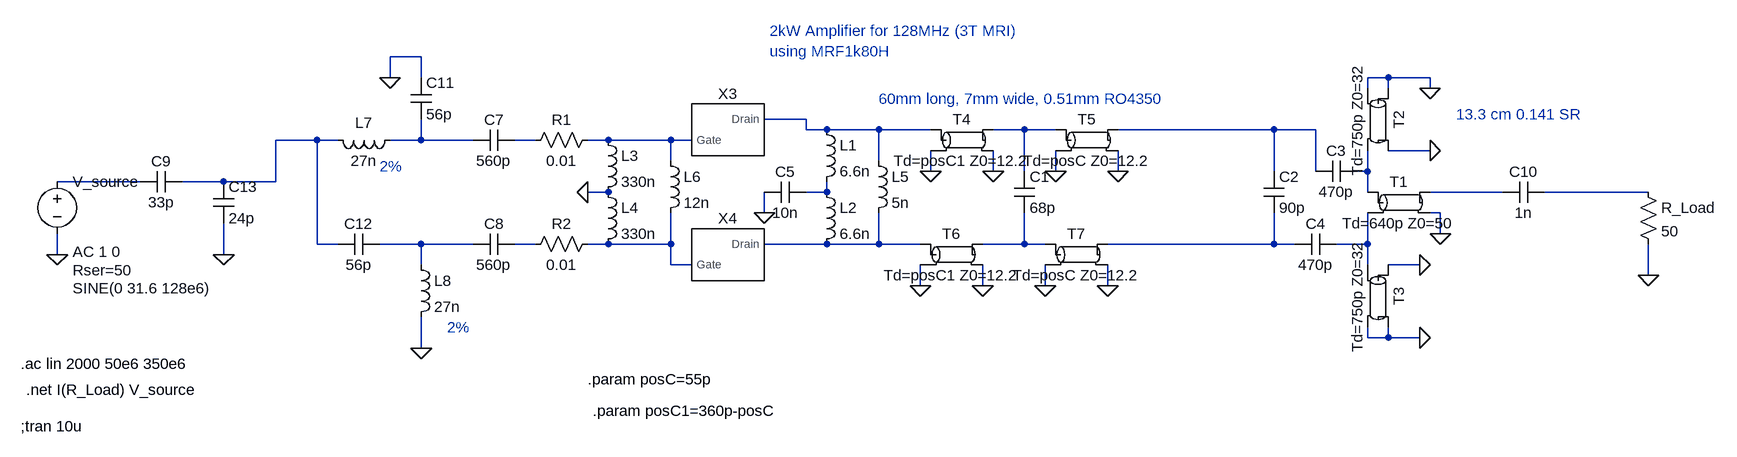
[diagram p0: schematic MRF1k80H_Board_50Ohm_longer_trace_no_Inductor_input_change_RO4350_Broad_input.asc]
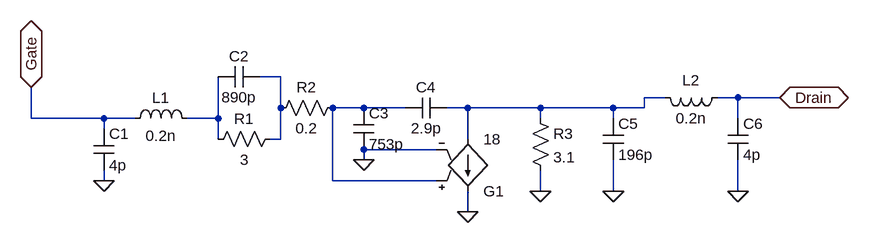
[diagram p1: sub-circuit mrfx1k80hhalf.asc]
MRF1k80H_Board_50Ohm_longer_trace_no_Inductor_input_change_RO4350_Broad_input.asc, the LTspice schematic file:
Version 4
SHEET 1 1664 680
WIRE -336 16 -384 16
WIRE -384 48 -384 16
WIRE -336 48 -336 16
WIRE 1152 48 1120 48
WIRE 1216 48 1152 48
WIRE 1120 64 1120 48
WIRE 1152 64 1152 48
WIRE 1216 64 1216 48
WIRE 256 112 192 112
WIRE 256 128 256 112
WIRE 288 128 256 128
WIRE 368 128 288 128
WIRE 448 128 368 128
WIRE 592 128 544 128
WIRE 640 128 592 128
WIRE 976 128 736 128
WIRE 1040 128 976 128
WIRE -496 144 -560 144
WIRE -464 144 -496 144
WIRE -336 144 -336 112
WIRE -336 144 -384 144
WIRE -256 144 -336 144
WIRE -160 144 -192 144
WIRE -48 144 -80 144
WIRE 48 144 -48 144
WIRE 80 144 48 144
WIRE 1216 160 1152 160
WIRE 48 176 48 144
WIRE 368 176 368 128
WIRE 448 192 448 160
WIRE 544 192 544 160
WIRE 592 192 592 128
WIRE 640 192 640 160
WIRE 736 192 736 160
WIRE 976 192 976 128
WIRE 1040 192 1040 128
WIRE 1120 192 1120 160
WIRE 1120 192 1104 192
WIRE -768 208 -896 208
WIRE -640 208 -704 208
WIRE -560 208 -560 144
WIRE -560 208 -640 208
WIRE -48 224 -80 224
WIRE 288 224 288 208
WIRE 288 224 256 224
WIRE 1120 224 1120 192
WIRE 1328 224 1216 224
WIRE 1552 224 1392 224
WIRE 192 256 192 224
WIRE 1232 256 1216 256
WIRE 1232 288 1232 256
WIRE -496 304 -496 144
WIRE -464 304 -496 304
WIRE -336 304 -400 304
WIRE -256 304 -336 304
WIRE -160 304 -192 304
WIRE -48 304 -80 304
WIRE 48 304 48 256
WIRE 48 304 -48 304
WIRE 288 304 192 304
WIRE 368 304 368 256
WIRE 368 304 288 304
WIRE 432 304 368 304
WIRE 592 304 592 256
WIRE 592 304 528 304
WIRE 624 304 592 304
WIRE 976 304 976 256
WIRE 976 304 720 304
WIRE 1008 304 976 304
WIRE 1120 304 1120 256
WIRE 1120 304 1072 304
WIRE -896 320 -896 288
WIRE -640 320 -640 272
WIRE -336 336 -336 304
WIRE 48 336 48 304
WIRE 80 336 48 336
WIRE 1120 336 1120 304
WIRE 1200 336 1152 336
WIRE 1552 352 1552 304
WIRE 432 368 432 336
WIRE 528 368 528 336
WIRE 624 368 624 336
WIRE 720 368 720 336
WIRE 1120 448 1120 432
WIRE 1152 448 1152 432
WIRE 1152 448 1120 448
WIRE 1200 448 1152 448
WIRE -336 464 -336 416
FLAG 1216 64 0
FLAG 1216 160 0
FLAG 1200 336 0
FLAG 1200 448 0
FLAG 1232 288 0
FLAG 192 256 0
FLAG 448 192 0
FLAG 544 192 0
FLAG 432 368 0
FLAG 528 368 0
FLAG 624 368 0
FLAG 720 368 0
FLAG 736 192 0
FLAG 640 192 0
FLAG 1552 352 0
FLAG -80 224 0
FLAG -640 320 0
FLAG -896 320 0
FLAG -336 464 0
FLAG -384 48 0
SYMBOL tline 1168 240 R0
SYMATTR InstName T1
SYMATTR Value Td=640p Z0=50
SYMBOL tline 1136 112 R90
SYMATTR InstName T2
SYMATTR Value Td=750p Z0=32
SYMBOL tline 1136 384 R90
SYMATTR InstName T3
SYMATTR Value Td=750p Z0=32
SYMBOL tline 496 144 R0
SYMATTR InstName T4
SYMATTR Value Td=posC1 Z0=12.2
SYMBOL tline 688 144 R0
SYMATTR InstName T5
SYMATTR Value Td=posC Z0=12.2
SYMBOL tline 480 320 R0
SYMATTR InstName T6
SYMATTR Value Td=posC1 Z0=12.2
SYMBOL tline 672 320 R0
SYMATTR InstName T7
SYMATTR Value Td=posC Z0=12.2
SYMBOL cap 576 192 R0
SYMATTR InstName C1
SYMATTR Value 68p
SYMATTR SpiceLine Rser=0.03
SYMBOL cap 960 192 R0
SYMATTR InstName C2
SYMATTR Value 90p
SYMATTR SpiceLine Rser=0.03
SYMBOL cap 1104 176 R90
WINDOW 0 0 32 VBottom 2
WINDOW 3 32 32 VTop 2
SYMATTR InstName C3
SYMATTR Value 470p
SYMBOL cap 1072 288 R90
WINDOW 0 0 32 VBottom 2
WINDOW 3 32 32 VTop 2
SYMATTR InstName C4
SYMATTR Value 470p
SYMBOL res 1536 208 R0
SYMATTR InstName R_Load
SYMATTR Value 50
SYMBOL ind 272 112 R0
SYMATTR InstName L1
SYMATTR Value 6.6n
SYMATTR SpiceLine Rser=0.04
SYMBOL ind 272 208 R0
SYMATTR InstName L2
SYMATTR Value 6.6n
SYMATTR SpiceLine Rser=0.04
SYMBOL cap 256 208 R90
WINDOW 0 0 32 VBottom 2
WINDOW 3 32 32 VTop 2
SYMATTR InstName C5
SYMATTR Value 10n
SYMBOL ind -64 128 R0
SYMATTR InstName L3
SYMATTR Value 330n
SYMATTR SpiceLine Rser=1 Rpar=1000000
SYMBOL ind -64 208 R0
SYMATTR InstName L4
SYMATTR Value 330n
SYMATTR SpiceLine Rser=1 Rpar=1000000
SYMBOL cap -192 128 R90
WINDOW 0 0 32 VBottom 2
WINDOW 3 32 32 VTop 2
SYMATTR InstName C7
SYMATTR Value 560p
SYMATTR SpiceLine Rser=0.01
SYMBOL cap -192 288 R90
WINDOW 0 0 32 VBottom 2
WINDOW 3 32 32 VTop 2
SYMATTR InstName C8
SYMATTR Value 560p
SYMATTR SpiceLine Rser=0.01
SYMBOL cap -704 192 R90
WINDOW 0 0 32 VBottom 2
WINDOW 3 32 32 VTop 2
SYMATTR InstName C9
SYMATTR Value 33p
SYMATTR SpiceLine Rser=0.25
SYMBOL voltage -896 192 R0
WINDOW 3 24 180 Left 2
WINDOW 123 24 124 Left 2
WINDOW 39 24 152 Left 2
SYMATTR Value SINE(0 31.6 128e6)
SYMATTR Value2 AC 1 0
SYMATTR SpiceLine Rser=50
SYMATTR InstName V_source
SYMBOL cap 1392 208 R90
WINDOW 0 0 32 VBottom 2
WINDOW 3 32 32 VTop 2
SYMATTR InstName C10
SYMATTR Value 1n
SYMBOL ind -368 128 R90
WINDOW 0 5 56 VBottom 2
WINDOW 3 32 56 VTop 2
SYMATTR InstName L7
SYMATTR Value 27n
SYMATTR SpiceLine Rser=0.1
SYMBOL ind -352 320 R0
SYMATTR InstName L8
SYMATTR Value 27n
SYMATTR SpiceLine Rser=0.1
SYMBOL cap -352 48 R0
SYMATTR InstName C11
SYMATTR Value 56p
SYMATTR SpiceLine Rser=0.02
SYMBOL cap -400 288 R90
WINDOW 0 0 32 VBottom 2
WINDOW 3 32 32 VTop 2
SYMATTR InstName C12
SYMATTR Value 56p
SYMATTR SpiceLine Rser=0.02
SYMBOL cap -656 208 R0
SYMATTR InstName C13
SYMATTR Value 24p
SYMATTR SpiceLine Rser=0.5
SYMBOL res -64 128 R90
WINDOW 0 0 56 VBottom 2
WINDOW 3 32 56 VTop 2
SYMATTR InstName R1
SYMATTR Value 0.01
SYMBOL res -64 288 R90
WINDOW 0 0 56 VBottom 2
WINDOW 3 32 56 VTop 2
SYMATTR InstName R2
SYMATTR Value 0.01
SYMBOL MRFX1k80Hhalf 128 128 R0
SYMATTR InstName X3
SYMBOL MRFX1k80Hhalf 128 320 R0
SYMATTR InstName X4
SYMBOL ind 352 160 R0
SYMATTR InstName L5
SYMATTR Value 5n
SYMBOL ind 32 160 R0
SYMATTR InstName L6
SYMATTR Value 12n
TEXT -80 512 Left 2 !.param posC=55p
TEXT 200 -24 Left 2 ;2kW Amplifier for 128MHz (3T MRI)\nusing MRF1k80H
TEXT -952 488 Left 2 !.ac lin 2000 50e6 350e6
TEXT -944 528 Left 2 !.net I(R_Load) V_source
TEXT -72 560 Left 2 !.param posC1=360p-posC
TEXT -952 584 Left 2 !;tran 10u
TEXT 1256 104 Left 2 ;13.3 cm 0.141 SR
TEXT 368 80 Left 2 ;60mm long, 7mm wide, 0.51mm RO4350
TEXT -296 432 Left 2 ;2%
TEXT -400 184 Left 2 ;2%

mrfx1k80hhalf.asc, the sub-circuit schematic file:
Version 4
SHEET 1 1228 680
WIRE 336 48 304 48
WIRE 928 80 896 80
WIRE 1040 80 1008 80
WIRE 1104 80 1040 80
WIRE 336 96 336 48
WIRE 464 96 416 96
WIRE 528 96 464 96
WIRE 624 96 592 96
WIRE 736 96 624 96
WIRE 848 96 736 96
WIRE 896 96 896 80
WIRE 896 96 848 96
WIRE -48 112 -48 64
WIRE 64 112 -48 112
WIRE 112 112 64 112
WIRE 240 112 240 48
WIRE 240 112 192 112
WIRE 736 112 736 96
WIRE 848 112 848 96
WIRE 1040 112 1040 80
WIRE 64 128 64 112
WIRE 240 144 240 112
WIRE 336 144 336 96
WIRE 336 144 320 144
WIRE 624 144 624 96
WIRE 576 160 464 160
WIRE 464 176 464 160
WIRE 64 208 64 192
WIRE 416 208 416 96
WIRE 576 208 416 208
WIRE 736 224 736 192
WIRE 848 224 848 176
WIRE 1040 224 1040 176
WIRE 624 256 624 224
FLAG 64 208 0
FLAG 464 176 0
FLAG 624 256 0
FLAG 736 224 0
FLAG 848 224 0
FLAG 1040 224 0
FLAG -48 64 Gate
IOPIN -48 64 BiDir
FLAG 1104 80 Drain
IOPIN 1104 80 BiDir
SYMBOL cap 48 128 R0
SYMATTR InstName C1
SYMATTR Value 4p
SYMBOL ind 96 128 R270
WINDOW 0 32 56 VTop 2
WINDOW 3 5 56 VBottom 2
SYMATTR InstName L1
SYMATTR Value 0.2n
SYMBOL cap 304 32 R90
WINDOW 0 0 32 VBottom 2
WINDOW 3 32 32 VTop 2
SYMATTR InstName C2
SYMATTR Value 890p
SYMBOL res 336 128 R90
WINDOW 0 0 56 VBottom 2
WINDOW 3 32 56 VTop 2
SYMATTR InstName R1
SYMATTR Value 3
SYMBOL res 432 80 R90
WINDOW 0 0 56 VBottom 2
WINDOW 3 32 56 VTop 2
SYMATTR InstName R2
SYMATTR Value 0.2
SYMBOL cap 448 96 R0
SYMATTR InstName C3
SYMATTR Value 753p
SYMBOL cap 592 80 R90
WINDOW 0 0 32 VBottom 2
WINDOW 3 32 32 VTop 2
SYMATTR InstName C4
SYMATTR Value 2.9p
SYMBOL g 624 240 M180
SYMATTR InstName G1
SYMATTR Value 18
SYMBOL res 720 96 R0
SYMATTR InstName R3
SYMATTR Value 3.1
SYMBOL cap 832 112 R0
SYMATTR InstName C5
SYMATTR Value 196p
SYMBOL ind 1024 64 R90
WINDOW 0 5 56 VBottom 2
WINDOW 3 32 56 VTop 2
SYMATTR InstName L2
SYMATTR Value 0.2n
SYMBOL cap 1024 112 R0
SYMATTR InstName C6
SYMATTR Value 4p

The netlist it stands for:
* MRF1k80H_Board_50Ohm_longer_trace_no_Inductor_input_change_RO4350_Broad_input.asc
T1 N008 N019 N011 0 Td=640p Z0=50
T2 0 0 0 N008 Td=750p Z0=32
T3 0 N019 0 0 Td=750p Z0=32
T4 N001 0 N002 0 Td=posC1 Z0=12.2
T5 N002 0 N003 0 Td=posC Z0=12.2
T6 N016 0 N017 0 Td=posC1 Z0=12.2
T7 N017 0 N018 0 Td=posC Z0=12.2
C1 N002 N017 68p Rser=0.03
C2 N003 N018 90p Rser=0.03
C3 N008 N003 470p
C4 N019 N018 470p
R_Load N012 0 50
L1 N001 N010 6.6n Rser=0.04
L2 N010 N016 6.6n Rser=0.04
C5 N010 0 10n
L3 N007 0 330n Rser=1 Rpar=1000000
L4 0 N015 330n Rser=1 Rpar=1000000
C7 N006 N005 560p Rser=0.01
C8 N014 N013 560p Rser=0.01
C9 N004 N009 33p Rser=0.25
V_source N009 0 SINE(0 31.6 128e6) AC 1 0 Rser=50
C10 N012 N011 1n
L7 N005 N004 27n Rser=0.1
L8 N013 0 27n Rser=0.1
C11 0 N005 56p Rser=0.02
C12 N013 N004 56p Rser=0.02
C13 N004 0 24p Rser=0.5
R1 N007 N006 0.01
R2 N015 N014 0.01
XX3 N001 N007 mrfx1k80hhalf
XX4 N016 N015 mrfx1k80hhalf
L5 N001 N016 5n
L6 N007 N015 12n

* block symbol definitions
.subckt mrfx1k80hhalf Drain Gate
C1 Gate 0 4p
L1 Gate N004 0.2n
C2 N001 N004 890p
R1 N001 N004 3
R2 N003 N001 0.2
C3 N003 0 753p
C4 N002 N003 2.9p
G1 N002 0 N003 0 18
R3 N002 0 3.1
C5 N002 0 196p
L2 Drain N002 0.2n
C6 Drain 0 4p
.ends mrfx1k80hhalf

.param posC=55p
* 2kW Amplifier for 128MHz (3T MRI)
* using MRF1k80H
.ac lin 2000 50e6 350e6
.net I(R_Load) V_source
.param posC1=360p-posC
;tran 10u
* 13.3 cm 0.141 SR
* 60mm long, 7mm wide, 0.51mm RO4350
* 2%
* 2%
.backanno
.end